# Altium project RF-Test-Board.PrjPcb (part 2 of 2)

## Sheet QPL9503.SchDoc
size A4; Organization: Altium Limited; Address1: L3, 12a Rodborough Rd; Address2: Frenchs Forest; Address3: NSW; Address4: Australia 2086; DocumentNumber: 7; SheetNumber: 7; SheetTotal: 7
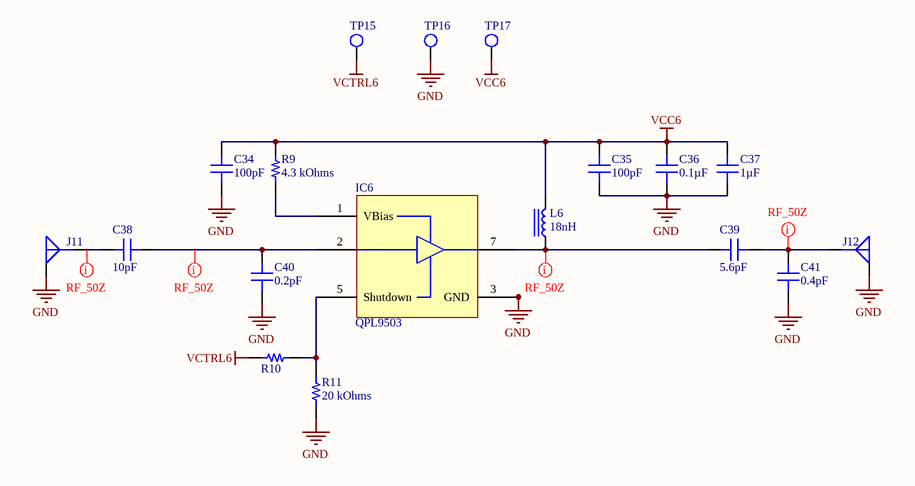
[diagram p6: QPL9503.SchDoc]

### Parts
C34  100pF  [CAP 0402_1005]
C35  100pF  [CAP 0402_1005]
C36  0.1µF  [CAP 0402_1005]
C37  1µF  [CAP 0402_1005]
C38  10pF  [CAP 0402_1005 RF]
C39  5.6pF  [CAP 0402_1005 RF]
C40  0.2pF  [CAP 0402_1005 RF]
C41  0.4pF  [CAP 0402_1005 RF]
IC6  QPL9503  [Qorvo LNA DFN-8 2X2]
J11  CON-SMA-EDGE-S  [CON-SMA-EDGE-S]  (value not drawn)
J12  CON-SMA-EDGE-S  [CON-SMA-EDGE-S]  (value not drawn)
L6  18nH  [0402CS]
R9  4.3 kOhms  [RES 0402_1005]
R10  (no value)  [RES 0402_1005]
R11  20 kOhms  [RES 0402_1005]
TP15  Test Point-THM  [KEYSTONE-THM-TestPoint]  (value not drawn)
TP16  Test Point-THM  [KEYSTONE-THM-TestPoint]  (value not drawn)
TP17  Test Point-THM  [KEYSTONE-THM-TestPoint]  (value not drawn)

### Nets
GND: C34.2 C35.1 C36.1 C37.1 C40.1 C41.1 IC6.3(GND) IC6.4(GND) IC6.6(GND) IC6.8(GND) IC6.9(GND) J11.2(G) J12.2(G) R11.1 TP16.1(TP)
VCC6: C34.1 C35.2 C36.2 C37.2 L6.2 R9.2 TP17.1(TP)
VCTRL6: R10.1 TP15.1(TP)
NetC38_1: C38.1 J11.1(S)
NetC38_2: C38.2 C40.2 IC6.2(IN)
NetC39_1: C39.1 IC6.7(OUT) L6.1
NetC39_2: C39.2 C41.2 J12.1(S)
NetIC6_1: IC6.1(VBias) R9.1
NetIC6_5: IC6.5(Shutdown) R10.2 R11.2

### Layout directives
net class RF_50Z: NetC38_1, NetC38_2, NetC39_1, NetC39_2

### Notes on the sheet
- Title
- Author:
- Murat Kucukyilmaz
- Number:
- Date:
- Sheet
- of

### Library data of the parts
C34 C35 = GCM1555C1H101FA16D: CAP CER 100PF 50V C0G/NP0 0402; Manufacturer: Murata Electronics; Temperature Coefficient: C0G, NP0; Tolerance: ±1%; Part Number: GCM1555C1H101FA16D; Value: 100pF; Applications: Automotive; Capacitance: 100pF; ComponentLink1Description: Datasheet; ComponentLink1URL: https://search.murata.co.jp/Ceramy/image/img/A01X/G101/ENG/GCM1555C1H101FA16-01.pdf; ComponentLink2Description: DigiKey Link; ComponentLink2URL: http://digikey.com/product-detail/en/murata-electronics/GCM1555C1H101FA16D/490-14349-1-ND/6606810; Device Package: 0402 (1005 Metric); LastUpdated: 2.09.2020 01:02:12; Lifecycle Status: Active; Minimum Order: 1; Mounting Type: Surface Mount, MLCC; Operating Temperature: -55°C ~ 125°C; Package / Case: 0402 (1005 Metric); Packaging: TapeAndReel; PartId: 7484; Part Status: Active; Price: 0.02; Ratings: AEC-Q200; Series: GCM; Size / Dimension: 0.039" L x 0.020" W (1.00mm x 0.50mm); Supplier 1: DigiKey; Supplier Part Number 1: 490-14349-1-ND; Thickness (Max): 0.022" (0.55mm); Voltage - Rated: 50V
C36 = EMK105B7104KV-F: CAP CER 0.1UF 16V X7R 0402; Manufacturer: Taiyo Yuden; Tolerance: ±10%; Part Number: EMK105B7104KV-F; Value: 0.1µF; Applications: General Purpose; Capacitance: 0.1µF; ComponentLink1Description: Datasheet; ComponentLink1URL: https://ds.yuden.co.jp/TYCOMPAS/ut/detail?pn=EMK105B7104KV-F  &u=M; ComponentLink2Description: DigiKey Link; ComponentLink2URL: http://digikey.com/product-detail/en/taiyo-yuden/EMK105B7104KV-F/587-1451-1-ND/1004082; Device Package: 0402 (1005 Metric); LastUpdated: 2.09.2020 01:02:15; Lifecycle Status: Active; Minimum Order: 1; Mounting Type: Surface Mount, MLCC; Operating Temperature: -55°C ~ 125°C; Package / Case: 0402 (1005 Metric); Packaging: CutTape; PartId: 6070; Part Status: Active; Price: 0.10; Series: M; Size / Dimension: 0.039" L x 0.020" W (1.00mm x 0.50mm); Supplier 1: DigiKey; Supplier Part Number 1: 587-1451-1-ND; Temperature Coefficient: X7R; Thickness (Max): 0.022" (0.55mm); Voltage - Rated: 16V
C37 = CL05A105KP5NNNC: CAP CER 1UF 10V X5R 0402; Manufacturer: Samsung Electro-Mechanics; Tolerance: ±10%; Part Number: CL05A105KP5NNNC; Value: 1µF; Applications: General Purpose; Capacitance: 1µF; ComponentLink1Description: Datasheet; ComponentLink1URL: http://www.samsungsem.com/kr/support/product-search/mlcc/CL05A105KP5NNNC.jsp; ComponentLink2Description: DigiKey Link; ComponentLink2URL: http://digikey.com/product-detail/en/samsung-electro-mechanics/CL05A105KP5NNNC/1276-1076-1-ND/3889162; Device Package: 0402 (1005 Metric); LastUpdated: 2.09.2020 01:02:21; Lifecycle Status: Active; Minimum Order: 1; Mounting Type: Surface Mount, MLCC; Operating Temperature: -55°C ~ 85°C; Package / Case: 0402 (1005 Metric); Packaging: TapeAndReel; PartId: 3103; Part Status: Active; Price: 0.01; Series: CL; Size / Dimension: 0.039" L x 0.020" W (1.00mm x 0.50mm); Supplier 1: DigiKey; Supplier Part Number 1: 1276-1076-1-ND; Temperature Coefficient: X5R; Thickness (Max): 0.022" (0.55mm); Voltage - Rated: 10V
C38 = GJM1555C1H100FB01D: CAP CER 10PF 50V C0G/NP0 0402; Manufacturer: Murata Electronics; Temperature Coefficient: C0G, NP0; Tolerance: ±1%; Part Number: GJM1555C1H100FB01D; Applications: RF, Microwave, High Frequency; Capacitance: 10pF; ComponentLink1Description: Datasheet; ComponentLink1URL: https://search.murata.co.jp/Ceramy/image/img/A01X/G101/ENG/GJM1555C1H100FB01-01.pdf; ComponentLink2Description: DigiKey Link; ComponentLink2URL: http://digikey.com/product-detail/en/murata-electronics/GJM1555C1H100FB01D/490-11189-1-ND/5333029; Device Package: 0402 (1005 Metric); Features: High Q, Low Loss; LastUpdated: 2.09.2020 01:17:07; Lifecycle Status: Active; Minimum Order: 1; Mounting Type: Surface Mount, MLCC; Operating Temperature: -55°C ~ 125°C; Package / Case: 0402 (1005 Metric); Packaging: TapeAndReel; PartId: 560; Part Status: Active; Price: 0.04; Series: GJM; Size / Dimension: 0.039" L x 0.020" W (1.00mm x 0.50mm); Supplier 1: DigiKey; Supplier Part Number 1: 490-11189-1-ND; Thickness (Max): 0.022" (0.55mm); Value: 10pF; Voltage - Rated: 50V
C39 = GJM1555C1H5R6CB01D: CAP CER 5.6PF 50V C0G/NP0 0402; Manufacturer: Murata Electronics; Temperature Coefficient: C0G, NP0; Tolerance: ±0.25pF; Part Number: GJM1555C1H5R6CB01D; Applications: RF, Microwave, High Frequency; Capacitance: 5.6pF; ComponentLink1Description: Datasheet; ComponentLink1URL: https://search.murata.co.jp/Ceramy/image/img/A01X/G101/ENG/GJM1555C1H5R6CB01-01.pdf; ComponentLink2Description: DigiKey Link; ComponentLink2URL: http://digikey.com/product-detail/en/murata-electronics/GJM1555C1H5R6CB01D/490-3103-1-ND/702369; Device Package: 0402 (1005 Metric); Features: High Q, Low Loss; LastUpdated: 2.09.2020 01:17:06; Lifecycle Status: Active; Minimum Order: 1; Mounting Type: Surface Mount, MLCC; Operating Temperature: -55°C ~ 125°C; Package / Case: 0402 (1005 Metric); Packaging: TapeAndReel; PartId: 1253; Part Status: Active; Price: 0.02; Series: GJM; Size / Dimension: 0.039" L x 0.020" W (1.00mm x 0.50mm); Supplier 1: DigiKey; Supplier Part Number 1: 490-3103-1-ND; Thickness (Max): 0.022" (0.55mm); Value: 5.6pF; Voltage - Rated: 50V
C40 = GJM1555C1HR20WB01D: CAP CER 0.2PF 50V C0G/NP0 0402; Manufacturer: Murata Electronics; Temperature Coefficient: C0G, NP0; Tolerance: ±0.05pF; Part Number: GJM1555C1HR20WB01D; Applications: RF, Microwave, High Frequency; Capacitance: 0.2pF; ComponentLink1Description: Datasheet; ComponentLink1URL: https://search.murata.co.jp/Ceramy/image/img/A01X/G101/ENG/GJM1555C1HR20WB01-01.pdf; ComponentLink2Description: DigiKey Link; ComponentLink2URL: http://digikey.com/product-detail/en/murata-electronics/GJM1555C1HR20WB01D/490-11247-1-ND/5333087; Device Package: 0402 (1005 Metric); Features: High Q, Low Loss; LastUpdated: 2.09.2020 01:17:04; Lifecycle Status: Active; Minimum Order: 1; Mounting Type: Surface Mount, MLCC; Operating Temperature: -55°C ~ 125°C; Package / Case: 0402 (1005 Metric); Packaging: TapeAndReel; PartId: 2057; Part Status: Active; Price: 0.05; Series: GJM; Size / Dimension: 0.039" L x 0.020" W (1.00mm x 0.50mm); Supplier 1: DigiKey; Supplier Part Number 1: 490-11247-1-ND; Thickness (Max): 0.022" (0.55mm); Value: 0.2pF; Voltage - Rated: 50V
C41 = GJM1555C1HR40BB01D: CAP CER 0.4PF 50V C0G/NP0 0402; Manufacturer: Murata Electronics; Temperature Coefficient: C0G, NP0; Tolerance: ±0.1pF; Part Number: GJM1555C1HR40BB01D; Applications: RF, Microwave, High Frequency; Capacitance: 0.4pF; ComponentLink1Description: Datasheet; ComponentLink1URL: https://search.murata.co.jp/Ceramy/image/img/A01X/G101/ENG/GJM1555C1HR40BB01-01.pdf; ComponentLink2Description: DigiKey Link; ComponentLink2URL: http://digikey.com/product-detail/en/murata-electronics/GJM1555C1HR40BB01D/490-3080-1-ND/702346; Device Package: 0402 (1005 Metric); Features: High Q, Low Loss; LastUpdated: 2.09.2020 01:17:06; Lifecycle Status: Active; Minimum Order: 1; Mounting Type: Surface Mount, MLCC; Operating Temperature: -55°C ~ 125°C; Package / Case: 0402 (1005 Metric); Packaging: TapeAndReel; PartId: 1529; Part Status: Active; Price: 0.03; Series: GJM; Size / Dimension: 0.039" L x 0.020" W (1.00mm x 0.50mm); Supplier 1: DigiKey; Supplier Part Number 1: 490-3080-1-ND; Thickness (Max): 0.022" (0.55mm); Value: 0.4pF; Voltage - Rated: 50V
IC6 = QPL9503: Ultra Low-Noise, Flat Gain LNA; Part Number: QPL9503; Supplier 1: Mouser; Supplier Part Number 1: 772-QPL9503T
J11 J12 = CON-SMA-EDGE-S: CONN SMA JACK STR EDGE MNT; Part Number: CON-SMA-EDGE-S; Supplier 1: Digi-Key; Supplier 2: Mouser; Supplier Part Number 1: CON-SMA-EDGE-S-ND; Supplier Part Number 2: 223-CON-SMA-EDGE-S
L6 = 0402CS-18NXJLW: Fixed Inductors 1005 18nH Unshld 5% 420mA 230mOhms AECQ2; Value: 18nH; Supplier 1: Mouser; Supplier Part Number 1: 994-0402CS-18NXJLW
R9 = RC0402FR-074K3L: RES SMD 4.3K OHM 1% 1/16W 0402; Manufacturer: Yageo; Power (Watts): 0.063W, 1/16W; Temperature Coefficient: ±100ppm/°C; Part Number: RC0402FR-074K3L; Value: 4.3 kOhms; ComponentLink1Description: Datasheet; ComponentLink1URL: https://www.yageo.com/upload/media/product/productsearch/datasheet/rchip/PYu-RC_Group_51_RoHS_L_10.pdf; ComponentLink2Description: DigiKey Link; ComponentLink2URL: http://digikey.com/product-detail/en/yageo/RC0402FR-074K3L/311-4.30KLRCT-ND/729551; Composition: Thick Film; Device Package: 0402 (1005 Metric); Features: Moisture Resistant; Height - Seated (Max): 0.016" (0.40mm); LastUpdated: 2.09.2020 01:07:27; Lifecycle Status: Active; Minimum Order: 1; Number of Terminations: 2; Operating Temperature: -55°C ~ 155°C; Package / Case: 0402 (1005 Metric); Packaging: CutTape; PartId: 20831; Part Status: Active; Price: 0.10; Resistance: 4.3 kOhms; Series: RC; Size / Dimension: 0.039" L x 0.020" W (1.00mm x 0.50mm); Supplier 1: DigiKey; Supplier Part Number 1: 311-4.30KLRCT-ND; Supplier Device Package: 0402; Tolerance: ±1%
R10 = RC0402JR-070RP: RES SMD 0 OHM JUMPER 1/16W 0402; Manufacturer: Yageo; Power (Watts): 0.063W, 1/16W; Part Number: RC0402JR-070RP; ComponentLink1Description: Datasheet; ComponentLink1URL: http://www.yageo.com/NewPortal/yageodocoutput?fileName=/pdf/R-Chip/PYu-RC_51_RoHS_P_0.pdf; ComponentLink2Description: DigiKey Link; ComponentLink2URL: http://digikey.com/product-detail/en/yageo/RC0402JR-070RP/YAG1279CT-ND/4935394; Composition: Thick Film; Device Package: 0402 (1005 Metric); Features: Moisture Resistant; Height - Seated (Max): 0.016" (0.40mm); LastUpdated: 2.09.2020 01:07:33; Lifecycle Status: Active; Minimum Order: 1; Number of Terminations: 2; Operating Temperature: -55°C ~ 155°C; Package / Case: 0402 (1005 Metric); Packaging: CutTape; PartId: 18920; Part Status: Active; Price: 0.10; Series: RC-P Lead Free; Size / Dimension: 0.039" L x 0.020" W (1.00mm x 0.50mm); Supplier 1: DigiKey; Supplier Part Number 1: YAG1279CT-ND; Supplier Device Package: 0402; Tolerance: Jumper
R11 = ERJ-2RKF2002X: RES SMD 20K OHM 1% 1/10W 0402; Manufacturer: Panasonic Electronic Components; Power (Watts): 0.1W, 1/10W; Temperature Coefficient: ±100ppm/°C; Part Number: ERJ-2RKF2002X; Value: 20 kOhms; ComponentLink1Description: Datasheet; ComponentLink1URL: https://industrial.panasonic.com/cdbs/www-data/pdf/RDA0000/AOA0000C304.pdf; ComponentLink2Description: DigiKey Link; ComponentLink2URL: http://digikey.com/product-detail/en/panasonic-electronic-components/ERJ-2RKF2002X/P20.0KLCT-ND/194250; Composition: Thick Film; Device Package: 0402 (1005 Metric); Features: Automotive AEC-Q200; Height - Seated (Max): 0.016" (0.40mm); LastUpdated: 2.09.2020 01:07:36; Lifecycle Status: Active; Minimum Order: 1; Number of Terminations: 2; Operating Temperature: -55°C ~ 155°C; Package / Case: 0402 (1005 Metric); Packaging: TapeAndReel; PartId: 17620; Part Status: Active; Price: 0.01; Ratings: AEC-Q200; Resistance: 20 kOhms; Series: ERJ; Size / Dimension: 0.039" L x 0.020" W (1.00mm x 0.50mm); Supplier 1: DigiKey; Supplier Part Number 1: P20.0KLCT-ND; Supplier Device Package: 0402; Tolerance: ±1%
TP15-TP17 = Test Point-THM: THRU HOLE MOUNT TEST POINTS; Supplier 1: Digi-Key; Supplier 2: Mouser; Supplier Part Number 1: 36-5012-ND; Supplier Part Number 2: 534-5012

## Nets that join several sheets
GND: RF-Test-Board-Sch (C43.1 C44.1 J13.2 J14.2), ADL5611 (8 pins), HMC326 (15 pins), QPA9127 (13 pins), QPL9058 (13 pins), QPL9547 (13 pins), QPL9503 (15 pins)